# Altium schematic sheet v1.0.SchDoc
size 58 x 45 mm
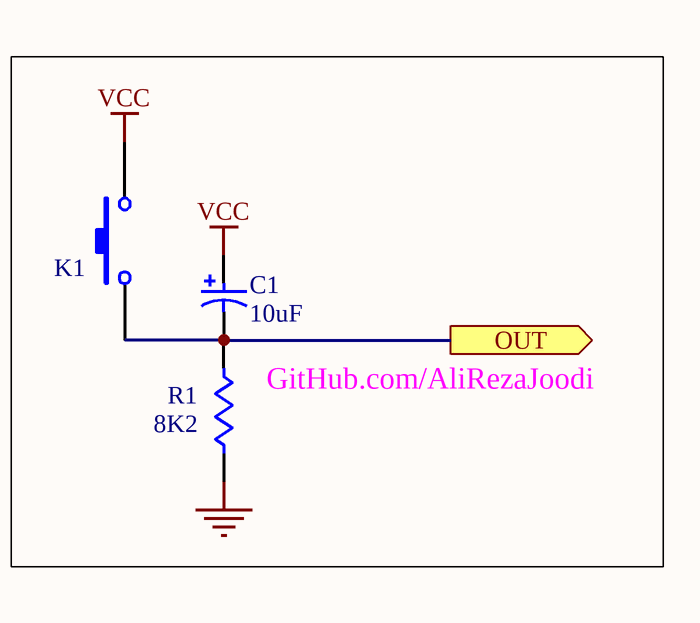
[diagram p0: v1.0.SchDoc]

## Parts
C1  10uF  [C_THD_EL_(P2.54-D6-H11)]
K1  SW-PB  [SPST-2_2]  (value not drawn)
R1  8K2  [AXIAL-0.4]

## Ports
OUT (out)

## Nets
GND: R1.1
VCC: C1.1 K1.2
OUT: C1.2 K1.1 R1.2 ; port OUT

## Notes on the sheet
- GitHub.com/AliRezaJoodi

## Library data of the parts
C1 = Capacitor_Electrolytic: Capacitor, Electrolytic; Revision: July-2002: Re-released for DXP Platform.
K1 = SW-PB: Switch; Manufacturer: Generic Components; Published: 24-Mar-1999; Revision: July-2002: Re-released for DXP Platform.; Publisher: Altium Limited
R1 = Res1: Resistor; Manufacturer: Generic Components; Class I: Passive; Published: 8-Jun-2000; Revision: July-2002: Re-released for DXP Platform.; Publisher: Altium Limited; Class II: Resistor